# Altium schematic sheet RT.SchDoc
size A; SheetNumber: 15; SheetTotal: 15
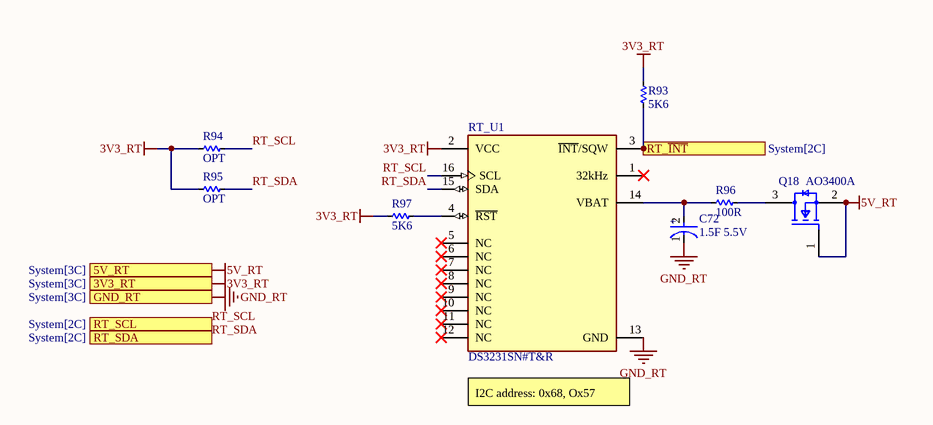
[diagram p0: RT.SchDoc]

## Parts
C72  1.5F 5.5V  [FP-FT0H474ZF-MFG]
Q18  AO3400A  [FP-SOT23-IPC_A]
R93  5K6  [RES-SMD-0603]
R94  OPT  [RES-SMD-0603]
R95  OPT  [RES-SMD-0603]
R96  100R  [RES-SMD-0805]
R97  5K6  [RES-SMD-0603]
RT_U1  DS3231SN#T&R  [FP-W16-H2-MFG]

## Ports
3V3_RT (see System[3C]), 5V_RT (see System[3C]), GND_RT (see System[3C]), RT_SCL (see System[2C]), RT_SDA (see System[2C]), RT_~{INT} (see System[2C])

## Nets
3V3_RT: R93.2 R94.2 R95.2 R97.2 RT_U1.2(VCC) ; port 3V3_RT
5V_RT: Q18.1(G) Q18.2(S) ; port 5V_RT
GND_RT: C72.1(C) RT_U1.13(GND) ; port GND_RT
RT_~{INT}: R93.1 RT_U1.3(~{INT}/SQW) ; port RT_~{INT}
RT_SCL: R94.1 RT_U1.16(SCL) ; port RT_SCL
RT_SDA: R95.1 RT_U1.15(SDA) ; port RT_SDA
NetC72_2: C72.2(A) R96.1 RT_U1.14(VBAT)
NetQ18_3: Q18.3(D) R96.2
NetR97_1: R97.1 RT_U1.4(~{RST})

Not connected (* = marked no-connect by the designer): RT_U1 1(32kHz)* 5(NC)* 6(NC)* 7(NC)* 8(NC)* 9(NC)* 10(NC)* 11(NC)* 12(NC)*

## Notes on the sheet
- (near RT_U1) I2C address: 0x68, Ox57
- (in symbol CMP-03024-000001-1) +

## Library data of the parts
C72 = CMP-03024-000001-1: Siêu tụ 1.5F 5.5V chân nằm SE-5R5-D155VYC3H; Manufacturer: KEMET; Manufacturer Part Number: FT0H474ZF; Capacitance: 0.47F; Tolerance: -20/+80%; Value: 0.47F; Octopart: https://octopart.com/ft0h474zf-kemet-30531665; Automotive: No; Device Class L3: Supercapacitors; Digikey Description: CAP 470MF -20% +80% 5.5V T/H; ComponentLink2Description: Datasheet; ComponentLink2URL: https://content.kemet.com/datasheets/KEM_S6014_FT.pdf; Device Class L1: Passive Components; Height: 13mm; Category: Cap; RoHS: TRUE; Lead Free: Yes; Temperature Range Low: -40°C; Temperature: -40°C to +85°C; Voltage Rating: 5.5V; Device Class L2: Capacitors; Package: FT0H474ZF; Mouser Description: Supercapacitors / Ultracapacitors 0.47F 5.5volts Radial Super Cap; Temperature Range High: +85°C
Q18 = CMP-83955-000006-1: OPT; Input Capacitance: 630pF; Drain to Source Voltage (Vdss): 30V; Number of Elements: 1; Rds On Max: 26.5mR; Max Power Dissipation: 1.4W; Continuous Drain Current (ID): 5.7A; Gate to Source Voltage (Vgs): 12V; Min Operating Temperature: -55°C; Lead Free: Lead Free; Number of Pins: 3; Case/Package: SOT-23; Mount: Surface Mount; Radiation Hardening: No; Packaging: Tape and Reel; Max Operating Temperature: 150°C; Power Dissipation: 1.4W
R93-R95 R97 = Res-SMD: Resistor 0603; Manufacturer: Generic Components; Class: Passive; Published: 08/06/2000; Publisher: Altium Hobart Technology Centre
R96 = Res-SMD: Res 0805; Manufacturer: Generic Components; Class: Passive; Published: 08/06/2000; Publisher: Altium Hobart Technology Centre
RT_U1 = CMP-0254-00375-2: IC RTC CLK/CALENDAR I2C 16-SOIC; Operating Supply Voltage: 3.3V; Max Supply Voltage: 5.5V; Logic Function: Clock; Time Format: HH:MM:SS; Date Format: YY-MM-DD-dd; Min Supply Voltage: 2.3V; Min Operating Temperature: -40°C; Packaging: Tape and Reel; Radiation Hardening: No; Package Quantity: 1000; Case/Package: SOIC; Max Operating Temperature: 85°C; Lead Free: Lead Free; Interface: I2C; Contact Plating: Tin; Number of Pins: 16; Mount: Surface Mount